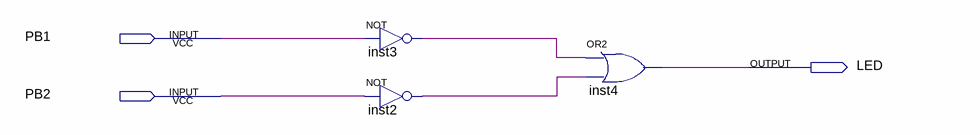
[diagram p0: schematic sheet]
// Quartus schematic Intro.bdf as structural Verilog: 3 symbols, 3 pins
module Intro (
  input  PB1,
  input  PB2,
  output LED
);

  wire inst2_out, inst3_out;

  not inst3 (inst3_out, PB1);
  not inst2 (inst2_out, PB2);
  or inst4 (LED, inst3_out, inst2_out);
endmodule
